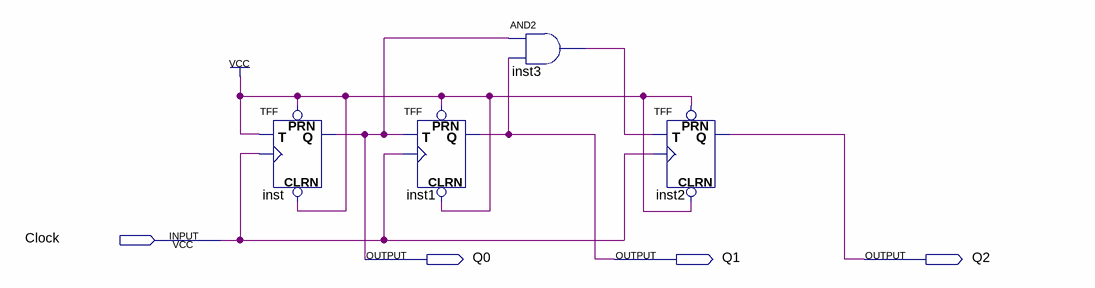
[diagram p0: schematic sheet]
// Quartus schematic 3bit_counter.bdf as structural Verilog: 4 symbols, 4 pins
module \3bit_counter  (
  input  Clock,
  output Q0,
  output Q1,
  output Q2
);

  wire inst3_out;

  TFF inst (.PRN(1'b1), .CLRN(1'b1), .T(1'b1), .CLK(Clock), .Q(Q0));
  TFF inst1 (.PRN(1'b1), .CLRN(1'b1), .T(Q0), .CLK(Clock), .Q(Q1));
  and inst3 (inst3_out, Q0, Q1);
  TFF inst2 (.PRN(1'b1), .CLRN(1'b1), .T(inst3_out), .CLK(Clock), .Q(Q2));
endmodule
